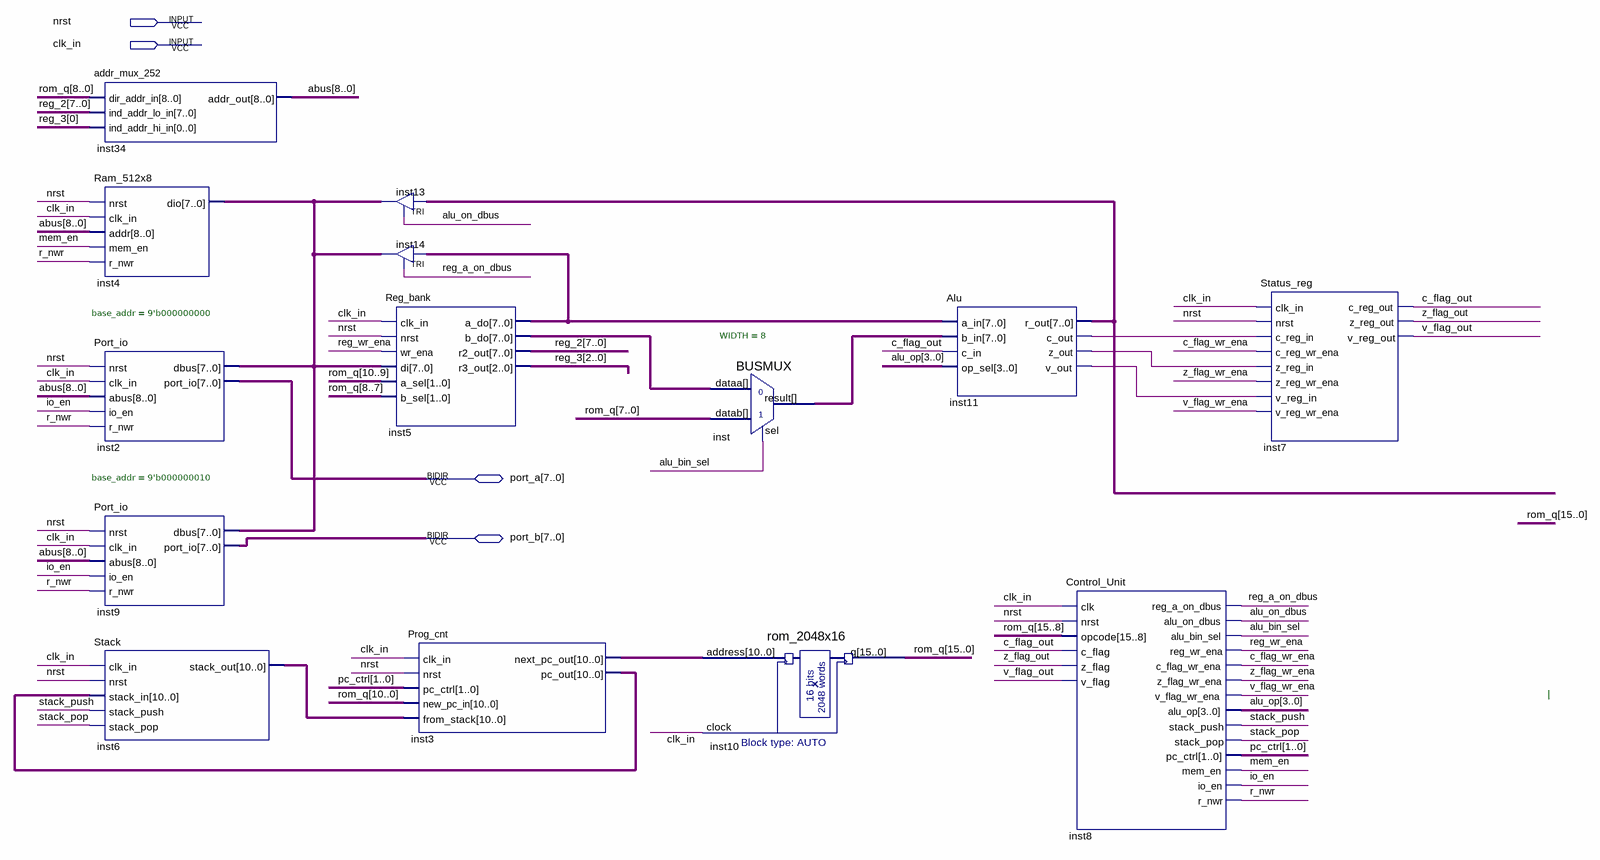
[diagram p0: schematic sheet]
// Quartus schematic Block_diagram.bdf as structural Verilog: 14 symbols, 4 pins
module Block_diagram (
  input  nrst,
  input  clk_in,
  inout  [7:0] port_a,
  inout  [7:0] port_b
);

  wire alu_bin_sel, alu_on_dbus, c_flag_out, c_flag_wr_ena, inst11_c_out, inst11_v_out, inst11_z_out, io_en,
       mem_en, r_nwr, reg_a_on_dbus, reg_wr_ena, stack_pop, stack_push, v_flag_out, v_flag_wr_ena,
       z_flag_out, z_flag_wr_ena;
  wire [1:0] pc_ctrl;
  wire [2:0] reg_3;
  wire [3:0] alu_op;
  wire [7:0] inst4_dio, inst5_a_do, inst5_b_do, inst11_r_out, inst_result, reg_2;
  wire [8:0] abus;
  wire [10:0] inst3_next_pc_out, inst3_pc_out, inst6_stack_out;
  wire [15:0] rom_q;

  addr_mux_252 inst34 (.dir_addr_in(rom_q[8:0]), .ind_addr_lo_in(reg_2), .ind_addr_hi_in(reg_3[0]), .addr_out(abus));
  Ram_512x8 inst4 (.nrst(nrst), .clk_in(clk_in), .addr(abus), .mem_en(mem_en), .r_nwr(r_nwr), .dio(inst4_dio));
  Port_io #(.base_addr(9'b000000000)) inst2 (
    .nrst(nrst), .clk_in(clk_in), .abus(abus), .io_en(io_en), .r_nwr(r_nwr), .dbus(inst4_dio),
    .port_io(port_a));
  Port_io #(.base_addr(9'b000000010)) inst9 (
    .nrst(nrst), .clk_in(clk_in), .abus(abus), .io_en(io_en), .r_nwr(r_nwr), .dbus(inst4_dio),
    .port_io(port_b));
  Stack inst6 (
    .clk_in(clk_in), .nrst(nrst), .stack_in(inst3_pc_out), .stack_push(stack_push), .stack_pop(stack_pop),
    .stack_out(inst6_stack_out));
  TRI inst13[7:0] (.IN(inst11_r_out), .OE(alu_on_dbus), .OUT(inst4_dio));
  TRI inst14[7:0] (.IN(inst5_a_do), .OE(reg_a_on_dbus), .OUT(inst4_dio));
  Reg_bank inst5 (
    .clk_in(clk_in), .nrst(nrst), .wr_ena(reg_wr_ena), .di(inst4_dio), .a_sel(rom_q[10:9]),
    .b_sel(rom_q[8:7]), .a_do(inst5_a_do), .b_do(inst5_b_do), .r2_out(reg_2), .r3_out(reg_3));
  Prog_cnt inst3 (
    .clk_in(clk_in), .nrst(nrst), .pc_ctrl(pc_ctrl), .new_pc_in(rom_q[10:0]), .from_stack(inst6_stack_out),
    .next_pc_out(inst3_next_pc_out), .pc_out(inst3_pc_out));
  BUSMUX #(.WIDTH(8)) inst (.datab(rom_q[7:0]), .sel(alu_bin_sel), .dataa(inst5_b_do), .result(inst_result));
  rom_2048x16 inst10 (.address(inst3_next_pc_out), .clock(clk_in), .q(rom_q));
  Alu inst11 (
    .a_in(inst5_a_do), .b_in(inst_result), .c_in(c_flag_out), .op_sel(alu_op), .r_out(inst11_r_out),
    .c_out(inst11_c_out), .z_out(inst11_z_out), .v_out(inst11_v_out));
  Control_Unit inst8 (
    .clk(clk_in), .nrst(nrst), .opcode(rom_q[15:8]), .c_flag(c_flag_out), .z_flag(z_flag_out),
    .v_flag(v_flag_out), .reg_a_on_dbus(reg_a_on_dbus), .alu_on_dbus(alu_on_dbus), .alu_bin_sel(alu_bin_sel),
    .reg_wr_ena(reg_wr_ena), .c_flag_wr_ena(c_flag_wr_ena), .z_flag_wr_ena(z_flag_wr_ena),
    .v_flag_wr_ena(v_flag_wr_ena), .alu_op(alu_op), .stack_push(stack_push), .stack_pop(stack_pop),
    .pc_ctrl(pc_ctrl), .mem_en(mem_en), .io_en(io_en), .r_nwr(r_nwr));
  Status_reg inst7 (
    .clk_in(clk_in), .nrst(nrst), .c_reg_in(inst11_c_out), .c_reg_wr_ena(c_flag_wr_ena),
    .z_reg_in(inst11_z_out), .z_reg_wr_ena(z_flag_wr_ena), .v_reg_in(inst11_v_out),
    .v_reg_wr_ena(v_flag_wr_ena), .c_reg_out(c_flag_out), .z_reg_out(z_flag_out), .v_reg_out(v_flag_out));

  // Notes on the sheet:
  //   |
endmodule
